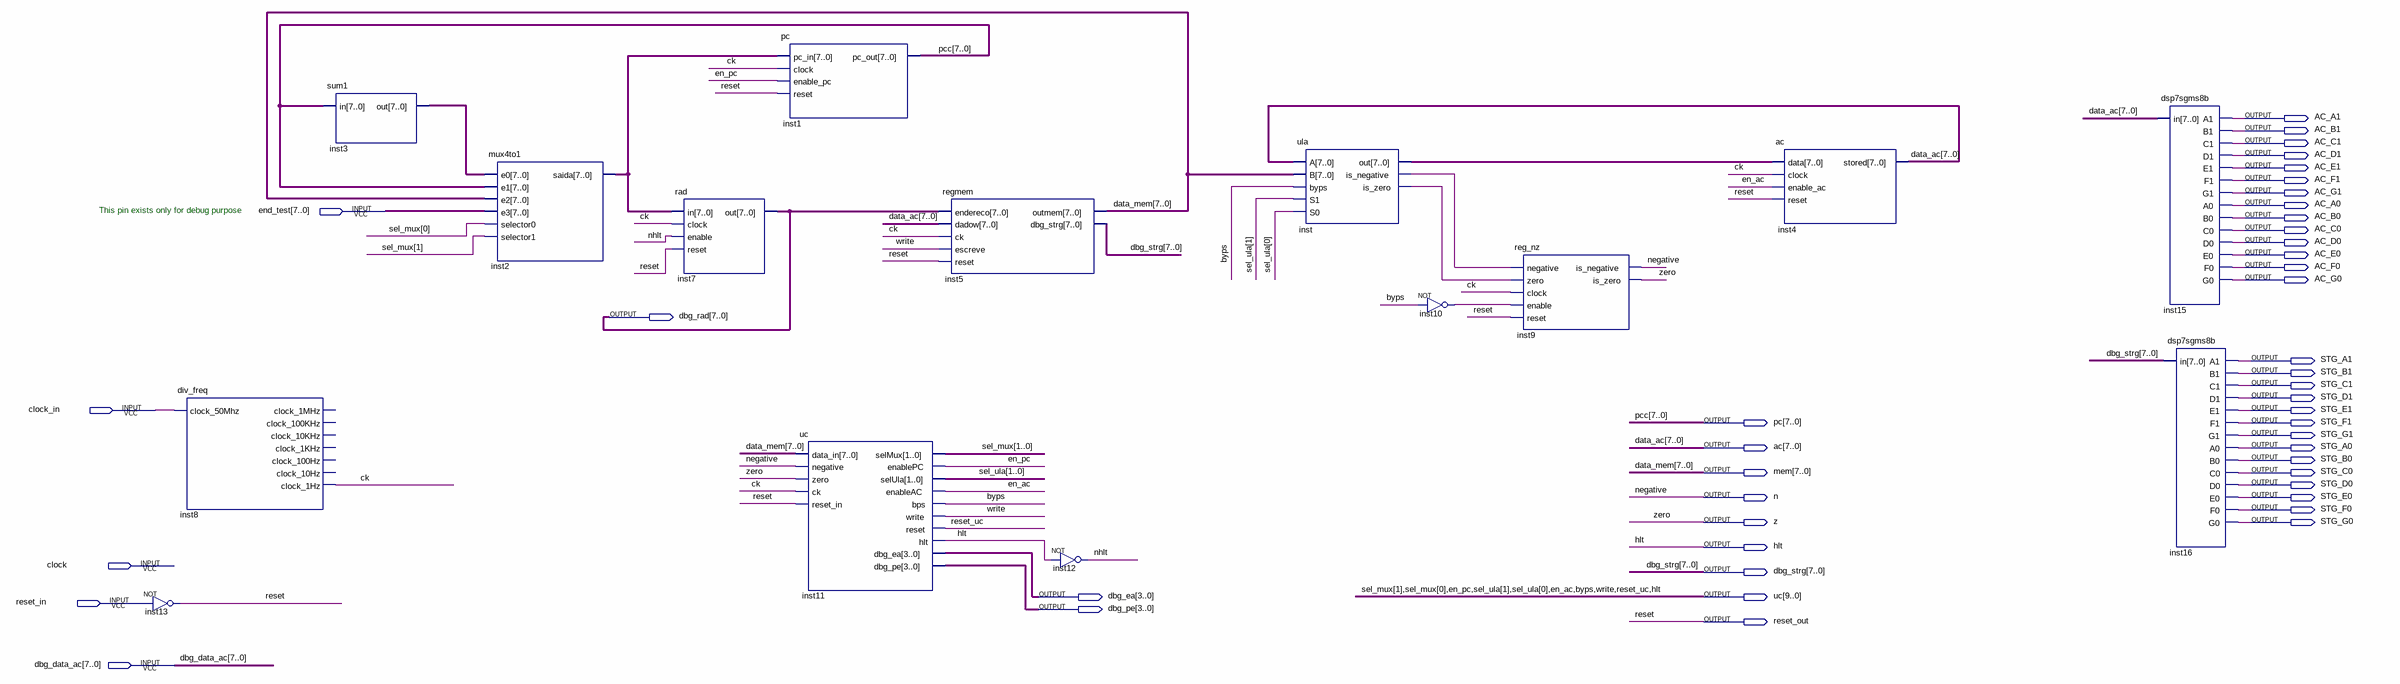
[diagram p0: schematic sheet]
// Quartus schematic neander.bdf as structural Verilog: 15 symbols, 45 pins
module neander (
  input  [7:0] end_test,
  input  clock_in,
  input  clock,
  input  reset_in,
  input  [7:0] dbg_data_ac,
  output AC_A1,
  output AC_B1,
  output AC_C1,
  output AC_D1,
  output AC_E1,
  output AC_F1,
  output AC_G1,
  output AC_A0,
  output AC_B0,
  output AC_C0,
  output AC_D0,
  output AC_E0,
  output AC_F0,
  output AC_G0,
  output [7:0] dbg_rad,
  output STG_A1,
  output STG_B1,
  output STG_C1,
  output STG_D1,
  output STG_E1,
  output [7:0] pc,
  output STG_F1,
  output STG_G1,
  output [7:0] ac,
  output STG_A0,
  output STG_B0,
  output [7:0] mem,
  output STG_C0,
  output STG_D0,
  output n,
  output STG_E0,
  output STG_F0,
  output z,
  output STG_G0,
  output hlt,
  output [7:0] dbg_strg,
  output [3:0] dbg_ea,
  output [9:0] uc,
  output [3:0] dbg_pe,
  output reset_out
);

  wire ck, inst10_out, inst_is_negative, inst_is_zero, nhlt;
  wire [7:0] inst2_saida, inst3_out, inst_out;

  div_freq inst8 (
    .clock_50Mhz(clock_in), .clock_1Hz(ck));  // open: clock_1MHz, clock_100KHz, clock_10KHz, clock_1KHz, clock_100Hz, clock_10Hz
  not inst13 (reset_out, reset_in);
  sum1 inst3 (.in(pc), .out(inst3_out));
  mux4to1 inst2 (
    .e0(inst3_out), .e1(pc), .e2(mem), .e3(end_test), .selector0(uc[8]), .selector1(uc[9]),
    .saida(inst2_saida));
  rad inst7 (.in(inst2_saida), .clock(ck), .enable(nhlt), .reset(reset_out), .out(dbg_rad));
  pc inst1 (.pc_in(inst2_saida), .clock(ck), .enable_pc(uc[7]), .reset(reset_out), .pc_out(pc));
  uc inst11 (
    .data_in(mem), .negative(n), .zero(z), .ck(ck), .reset_in(reset_out), .selMux(uc[9:8]), .enablePC(uc[7]),
    .selUla(uc[6:5]), .enableAC(uc[4]), .bps(uc[3]), .write(uc[2]), .reset(uc[1]), .hlt(hlt),
    .dbg_ea(dbg_ea), .dbg_pe(dbg_pe));
  regmem inst5 (
    .endereco(dbg_rad), .dadow(ac), .ck(ck), .escreve(uc[2]), .reset(reset_out), .outmem(mem),
    .dbg_strg(dbg_strg));
  not inst12 (nhlt, hlt);
  ula inst (
    .A(ac), .B(mem), .byps(uc[3]), .S1(uc[6]), .S0(uc[5]), .out(inst_out), .is_negative(inst_is_negative),
    .is_zero(inst_is_zero));
  not inst10 (inst10_out, uc[3]);
  reg_nz inst9 (
    .negative(inst_is_negative), .zero(inst_is_zero), .clock(ck), .enable(inst10_out), .reset(reset_out),
    .is_negative(n), .is_zero(z));
  ac inst4 (.data(inst_out), .clock(ck), .enable_ac(uc[4]), .reset(reset_out), .stored(ac));
  dsp7sgms8b inst15 (
    .in(ac), .A1(AC_A1), .B1(AC_B1), .C1(AC_C1), .D1(AC_D1), .E1(AC_E1), .F1(AC_F1), .G1(AC_G1), .A0(AC_A0),
    .B0(AC_B0), .C0(AC_C0), .D0(AC_D0), .E0(AC_E0), .F0(AC_F0), .G0(AC_G0));
  dsp7sgms8b inst16 (
    .in(dbg_strg), .A1(STG_A1), .B1(STG_B1), .C1(STG_C1), .D1(STG_D1), .E1(STG_E1), .F1(STG_F1), .G1(STG_G1),
    .A0(STG_A0), .B0(STG_B0), .C0(STG_C0), .D0(STG_D0), .E0(STG_E0), .F0(STG_F0), .G0(STG_G0));

  assign uc[0] = hlt;

  // Other names for the same wires on the sheet: byps = uc[3]; data_ac[7:0] = ac; data_mem[7:0] = mem; en_ac = uc[4];
  //   en_pc = uc[7]; negative = n; pcc[7:0] = pc; reset = reset_out; reset_uc = uc[1]; sel_mux[1:0] = uc[9:8];
  //   sel_ula[1:0] = uc[6:5]; write = uc[2]; zero = z

  // Notes on the sheet:
  //   This pin exists only for debug purpose
endmodule
